# Altium schematic sheet FSR Current-to-Voltage Converter.SchDoc: FSR Current-to-Voltage Converter
size A4; Engineer: WangWen; Time: 2017.4.2
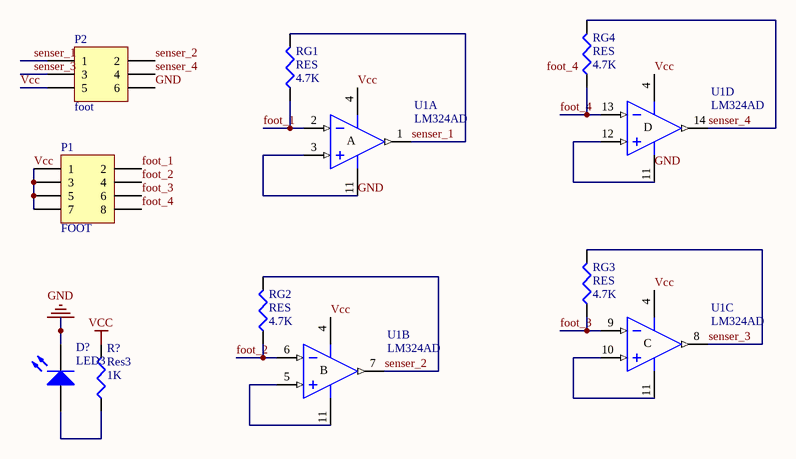
[diagram p0: FSR Current-to-Voltage Converter.SchDoc]

## Parts
D?  LED3  [6-0805_N]
P1  FOOT  [HDR2X4]
P2  foot  [HDR2X3]
R?  Res3  value 1K  [6-0805_N]
RG1  RES  value 4.7K  [6-0805_N]
RG2  RES  value 4.7K  [6-0805_N]
RG3  RES  value 4.7K  [6-0805_N]
RG4  RES  value 4.7K  [6-0805_N]
U1  LM324AD  [SO14_N]  (parts A,B,C,D of 4)

## Nets
GND: D?.2(K) P2.6 U1.3(IN+) U1.11(V-)
Vcc: P1.1 P1.3 P1.5 P1.7 P2.5 R?.2 U1.4(V+)
foot_1: P1.2 RG1.1 U1.2(IN-)
foot_2: P1.4 RG2.1 U1.6(IN-)
foot_3: P1.6 RG3.1 U1.9(IN-)
foot_4: P1.8 RG4.1 U1.13(IN-)
senser_1: P2.1 RG1.2 U1.1(OUT)
senser_2: P2.2 RG2.2 U1.7(OUT)
senser_3: P2.3 RG3.2 U1.8(OUT)
senser_4: P2.4 RG4.2 U1.14(OUT)
NetD?_1: D?.1(A) R?.1
NetU1_5: U1.5(IN+) U1.11(V-)
NetU1_10: U1.10(IN+) U1.11(V-)
NetU1_11: U1.11(V-) U1.12(IN+)

## Notes on the sheet
- Labels drawn without touching a wire or pin: foot_4, GND
- (in symbol LM324AD, part A) A
- (in symbol LM324AD, part B) B
- (in symbol LM324AD, part C) C
- (in symbol LM324AD, part D) D

## Library data of the parts
D? = LED3: Typical BLUE SiC LED; Published: 8-Jun-2000; LatestRevisionDate: 17-Dec-2003; LatestRevisionNote: PCB Footprint replaced.; DatasheetVersion: 16-Apr-2002; PackageVersion: 16-Apr-2002; PackageReference: 3.5X2.8X1.9; Publisher: Altium Limited
P1 = Header 4X2: Header, 4-Pin, Dual row; LatestRevisionDate: 17-Jul-2002; LatestRevisionNote: Re-released for DXP Platform.; Publisher: Altium Limited
P2 = Header 3X2: Header, 3-Pin, Dual row; LatestRevisionDate: 17-Jul-2002; LatestRevisionNote: Re-released for DXP Platform.; Publisher: Altium Limited
R? RG1-RG4 = Res3: Resistor; Published: 8-Jun-2000; LatestRevisionDate: 29-May-2009; LatestRevisionNote: IPC-7351 Footprint Added.; PackageReference: J1-0603; Publisher: Altium Limited; PackageDescription: Chip Resistor
U1 = LM324AD: Low-Power Quad Operational Amplifier; Published: 24-Aug-2001; LatestRevisionDate: 13-Apr-2006; LatestRevisionNote: IPC-7351 Footprint Added.; DatasheetVersion: Nov-1997; PackageVersion: Sep-1998; PackageReference: SO14; Publisher: Altium Limited; PackageDescription: 14-Pin Small Outline Integrated Circuit 1.27 mm Pitch; Code_IPC: SOIC127P600-14; ComponentLink1Description: Manufacturer Link; ComponentLink1URL: http://www.st.com/; ComponentLink2Description: Datasheet; ComponentLink2URL: http://www.st.com/stonline/products/literature/ds/4797/lm224a.pdf